# EAGLE design vco (EAGLE 9.6.2)

## Sheet 1 of 2
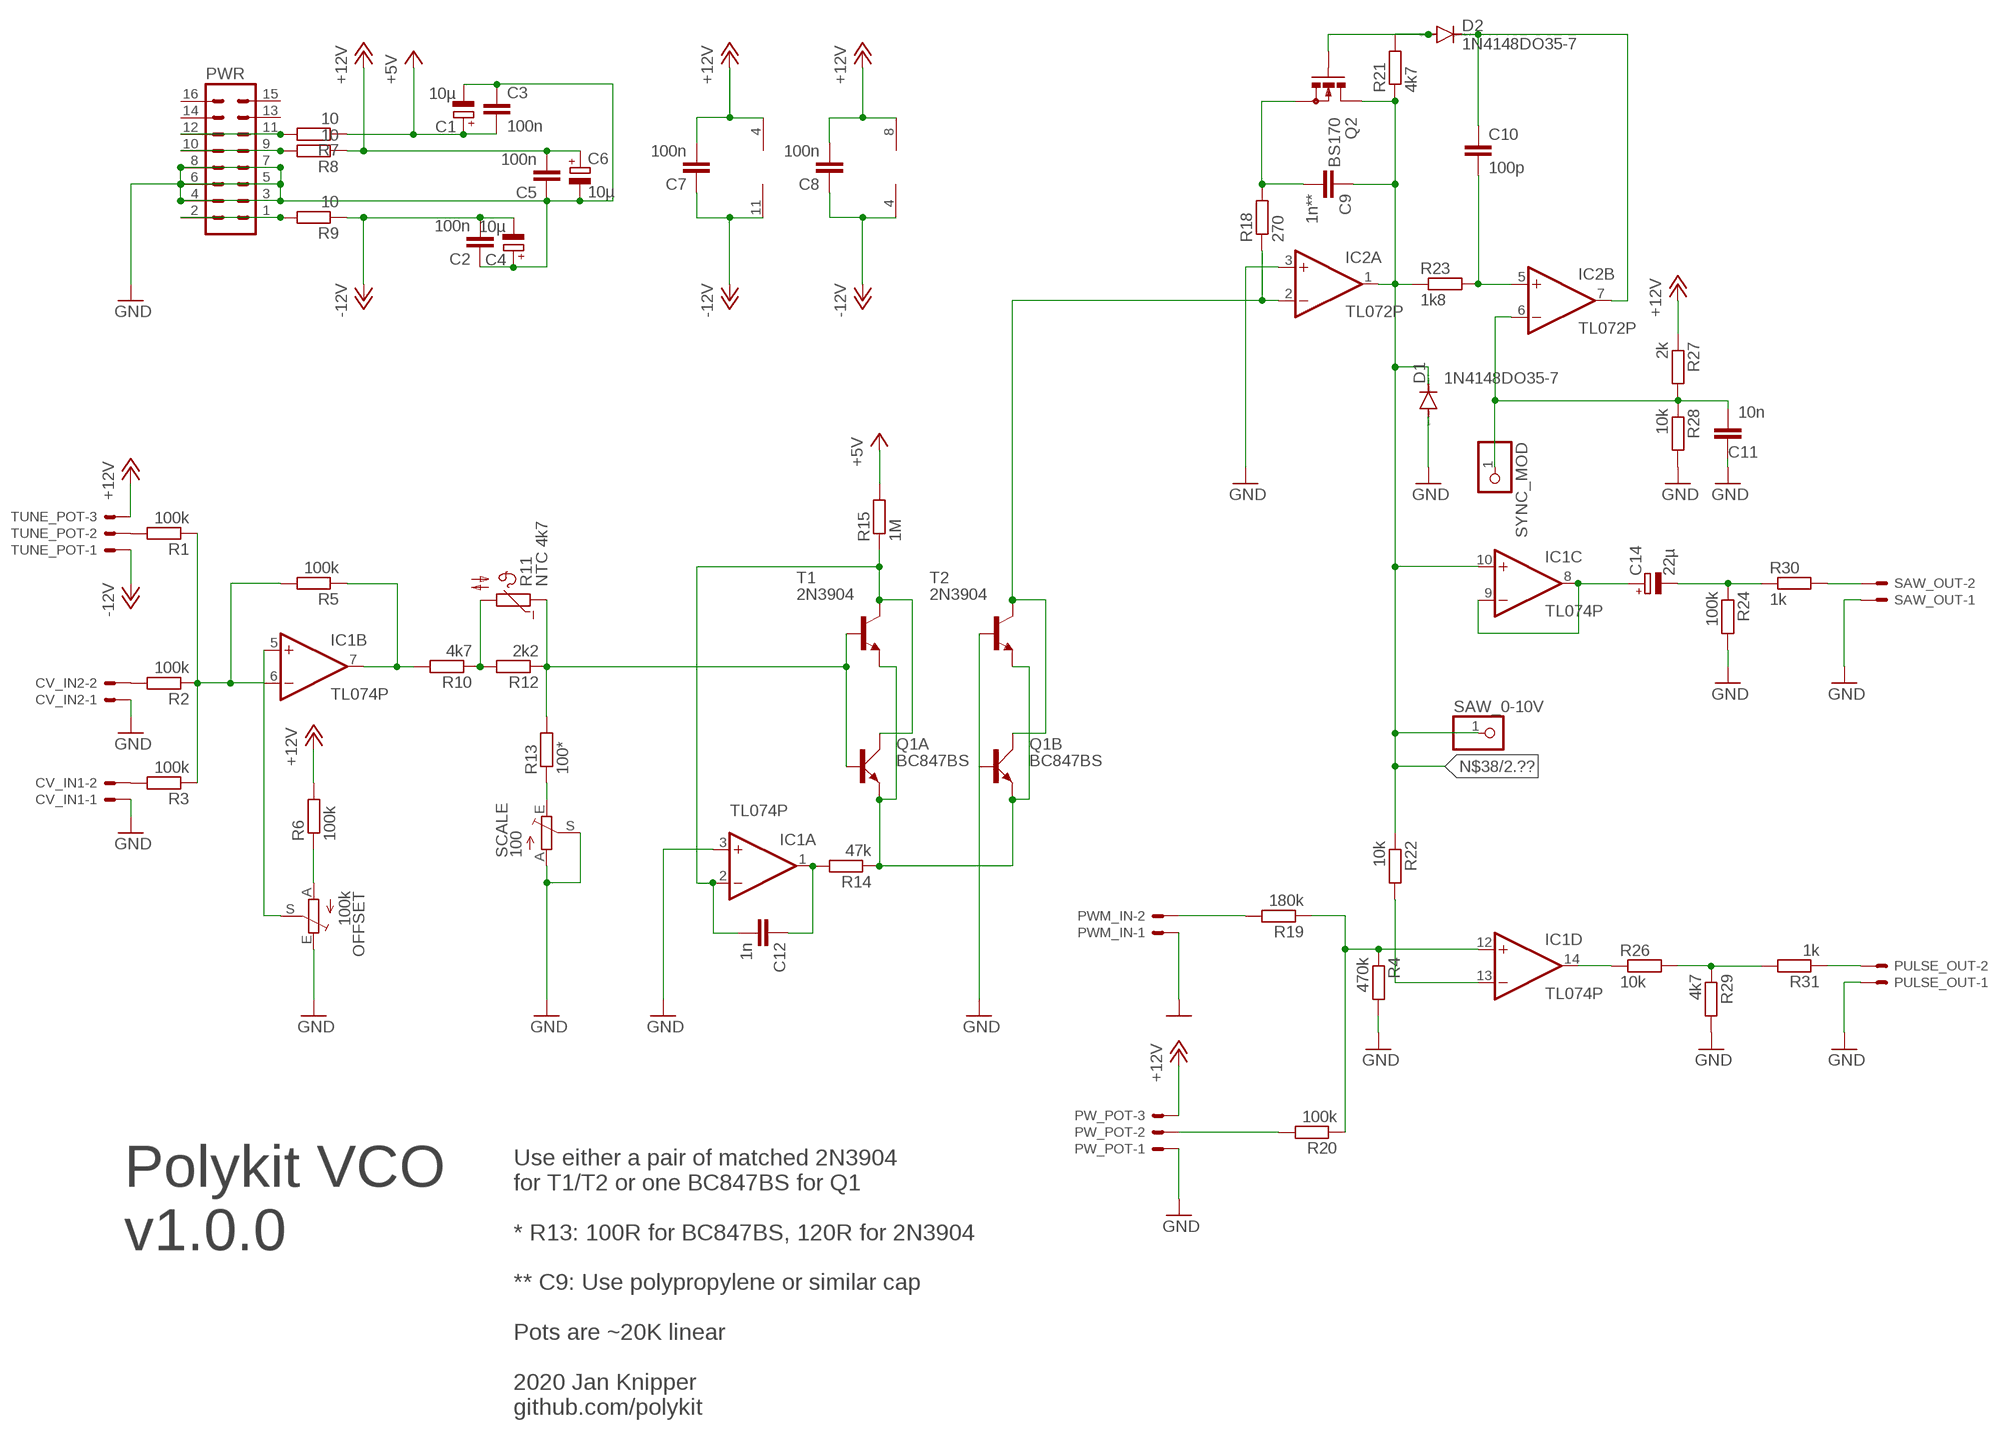
[diagram p0: schematic, sheet 1]

### Parts
C1  10µ  CPOL-EUE2.5-5  [E2,5-5]
C2  100n  C-EU050-030X075  [C050-030X075]
C3  100n  C-EU050-030X075  [C050-030X075]
C4  10µ  CPOL-EUE2.5-5  [E2,5-5]
C5  100n  C-EU050-030X075  [C050-030X075]
C6  10µ  CPOL-EUE2.5-5  [E2,5-5]
C7  100n  C-EU050-030X075  [C050-030X075]
C8  100n  C-EU050-030X075  [C050-030X075]
C9  1n**  C-EU050-030X075  [C050-030X075]
C10  100p  C-EU050-030X075  [C050-030X075]
C11  10n  C-EU050-030X075  [C050-030X075]
C12  1n  C-EU050-024X044  [C050-024X044]
C14  22µ  CPOL-EUE2.5-5  [E2,5-5]
CV_IN1  22-23-2021  [22-23-2021]
CV_IN2  22-23-2021  [22-23-2021]
D1  1N4148DO35-7  [DO35-7]
D2  1N4148DO35-7  [DO35-7]
IC1  TL074P  [DIL14]
IC2  TL072P  [DIL08]
OFFSET  100k  TRIM_1234-S64YW  [S64YW]
PULSE_OUT  22-23-2021  [22-23-2021]
PW_POT  22-23-2031  [22-23-2031]
PWM_IN  22-23-2021  [22-23-2021]
PWR  ML16  [ML16]
Q1  BC847BS  [SOT363_PHILIPS]
Q2  BS170  [SOT54E]
R1  100k  R-EU_0207/7  [0207/7]
R2  100k  R-EU_0207/7  [0207/7]
R3  100k  R-EU_0207/7  [0207/7]
R4  470k  R-EU_0207/7  [0207/7]
R5  100k  R-EU_0207/7  [0207/7]
R6  100k  R-EU_0207/7  [0207/7]
R7  10  R-EU_0207/7  [0207/7]
R8  10  R-EU_0207/7  [0207/7]
R9  10  R-EU_0207/7  [0207/7]
R10  4k7  R-EU_0207/7  [0207/7]
R11  NTC 4k7  NTC640  [P640]
R12  2k2  R-EU_0207/7  [0207/7]
R13  100*  R-EU_0207/7  [0207/7]
R14  47k  R-EU_0207/7  [0207/7]
R15  1M  R-EU_0207/7  [0207/7]
R18  270  R-EU_0207/7  [0207/7]
R19  180k  R-EU_0207/7  [0207/7]
R20  100k  R-EU_0207/7  [0207/7]
R21  4k7  R-EU_0207/7  [0207/7]
R22  10k  R-EU_0207/7  [0207/7]
R23  1k8  R-EU_0207/7  [0207/7]
R24  100k  R-EU_0207/7  [0207/7]
R26  10k  R-EU_0207/7  [0207/7]
R27  2k  R-EU_0207/7  [0207/7]
R28  10k  R-EU_0207/7  [0207/7]
R29  4k7  R-EU_0207/7  [0207/7]
R30  1k  R-EU_0207/7  [0207/7]
R31  1k  R-EU_0207/7  [0207/7]
SAW_0-10V  PINHD-1X1  [1X01]
SAW_OUT  22-23-2021  [22-23-2021]
SCALE  100  TRIM_1234-S64YW  [S64YW]
SYNC_MOD  PINHD-1X1  [1X01]
T1  2N3904  [TO92]
T2  2N3904  [TO92]
TUNE_POT  22-23-2031  [22-23-2031]

### Nets
+5V: C1.+ C3.2 R7.1 R15.2
+12V: C5.2 C6.+ C7.2 C8.2 IC1.4(P:V+) IC2.8(P:V+) PW_POT.3 R6.2 R8.1 R27.1 TUNE_POT.3 ; also sheet 2
-12V: C2.2 C4.- C7.1 C8.1 IC1.11(P:V-) IC2.4(P:V-) R9.1 TUNE_POT.1
GND: C1.- C2.1 C3.1 C4.+ C5.1 C6.- C11.1 CV_IN1.1 CV_IN2.1 D1.A IC1.3(A:+IN) IC2.3(A:+IN) OFFSET.E PULSE_OUT.1 PW_POT.1 PWM_IN.1 PWR.3 PWR.4 PWR.5 PWR.6 PWR.7 PWR.8 Q1.5(B:B) R4.2 R24.2 R28.2 R29.2 SAW_OUT.1 SCALE.A SCALE.S T2.2(B) ; also sheet 2
N$1: PWR.1 PWR.2 R9.2
N$2: Q1.1(A:E) Q1.4(B:E) R14.1 T1.3(E) T2.3(E)
N$3: C12.2 IC1.2(A:-IN) Q1.6(A:C) R15.1 T1.1(C)
N$4: PWR.9 PWR.10 R8.2
N$5: Q1.2(A:B) R11.1 R12.1 R13.2 T1.2(B)
N$6: C14.- R24.1 R30.1
N$7: PULSE_OUT.2 R31.1
N$9: IC1.7(B:OUT) R5.1 R10.2
N$10: R1.2 TUNE_POT.2
N$11: C10.1 D2.C IC2.7(B:OUT)
N$14: OFFSET.A R6.1
N$15: CV_IN2.2 R2.2
N$16: CV_IN1.2 R3.2
N$19: C14.+ IC1.8(C:OUT) IC1.9(C:-IN)
N$20: R30.2 SAW_OUT.2
N$22: IC1.13(D:-IN) R22.2
N$24: IC1.14(D:OUT) R26.1
N$25: R26.2 R29.1 R31.2
N$26: IC1.12(D:+IN) R4.1 R19.1 R20.1
N$27: PWM_IN.2 R19.2
N$28: PW_POT.2 R20.2
N$29: IC1.5(B:+IN) OFFSET.S
N$30: R10.1 R11.2 R12.2
N$31: C10.2 IC2.5(B:+IN) R23.2
N$33: PWR.11 PWR.12 R7.2
N$34: C12.1 IC1.1(A:OUT) R14.2
N$36: C9.2 Q2.S R18.2
N$37: D2.A Q2.G R21.2
N$38: C9.1 D1.C IC1.10(C:+IN) IC2.1(A:OUT) Q2.D R21.1 R22.1 R23.1 SAW_0-10V.1 ; also sheet 2
N$39: C11.2 IC2.6(B:-IN) R27.2 R28.1 SYNC_MOD.1
N$40: IC2.2(A:-IN) Q1.3(B:C) R18.1 T2.1(C)
N$50: R13.1 SCALE.E
N$51: IC1.6(B:-IN) R1.1 R2.1 R3.1 R5.2
Unconnected: OFFSET.S@1(S) PWR.13 PWR.14 PWR.15 PWR.16 SCALE.S@1(S)

### Notes on the sheet
- Use either a pair of matched 2N3904
  for T1/T2 or one BC847BS for Q1
  
  * R13: 100R for BC847BS, 120R for 2N3904
  
  ** C9: Use polypropylene or similar cap
  
  Pots are ~20K linear
  
  2020 Jan Knipper
  github.com/polykit
- Polykit VCO
  v1.0.0

## Sheet 2 of 2
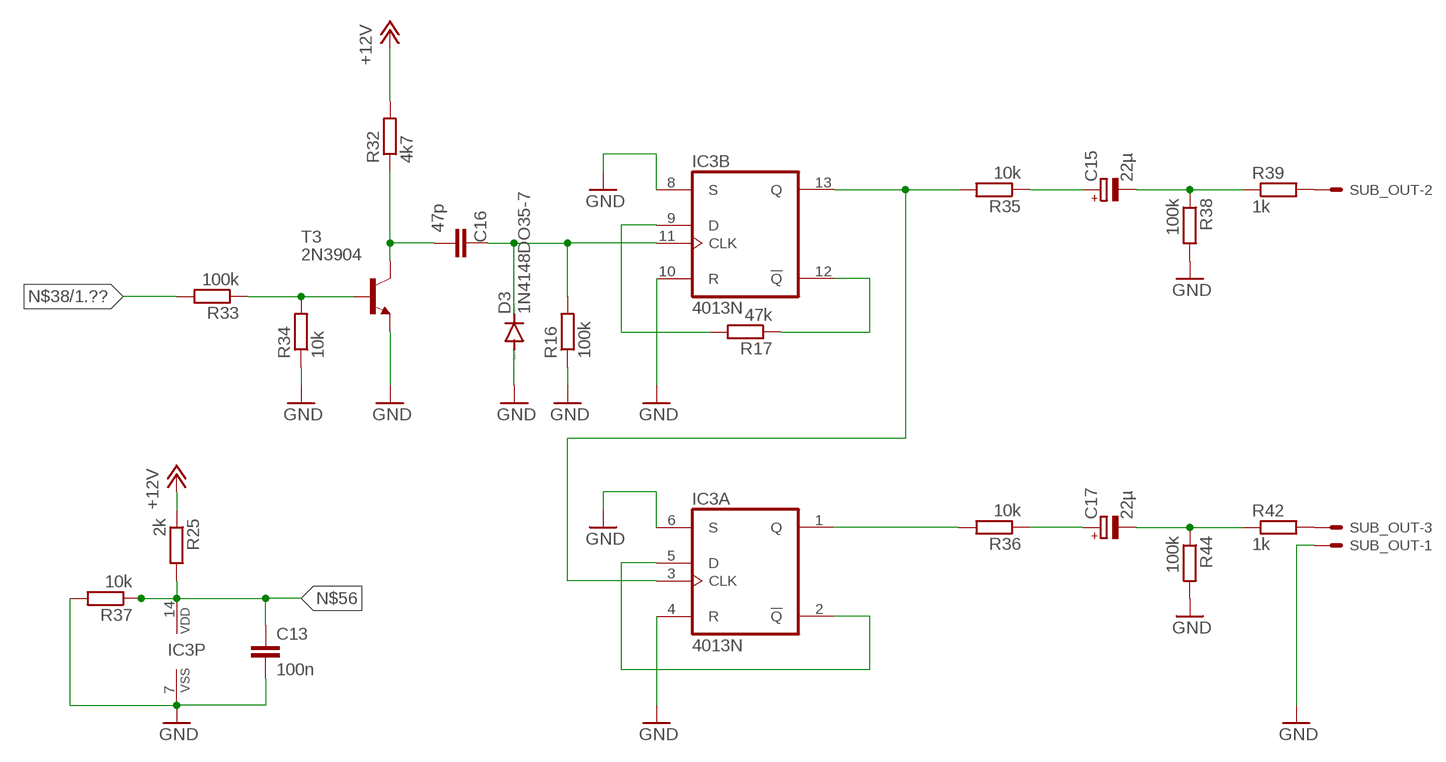
[diagram p1: schematic, sheet 2]

### Parts
C13  100n  C-EU050-030X075  [C050-030X075]
C15  22µ  CPOL-EUE2.5-5  [E2,5-5]
C16  47p  C-EU050-030X075  [C050-030X075]
C17  22µ  CPOL-EUE2.5-5  [E2,5-5]
D3  1N4148DO35-7  [DO35-7]
IC3  4013N  [DIL14]
R16  100k  R-EU_0207/7  [0207/7]
R17  47k  R-EU_0207/7  [0207/7]
R25  2k  R-EU_0207/7  [0207/7]
R32  4k7  R-EU_0207/7  [0207/7]
R33  100k  R-EU_0207/7  [0207/7]
R34  10k  R-EU_0207/7  [0207/7]
R35  10k  R-EU_0207/7  [0207/7]
R36  10k  R-EU_0207/7  [0207/7]
R37  10k  R-EU_0207/7  [0207/7]
R38  100k  R-EU_0207/7  [0207/7]
R39  1k  R-EU_0207/7  [0207/7]
R42  1k  R-EU_0207/7  [0207/7]
R44  100k  R-EU_0207/7  [0207/7]
SUB_OUT  22-23-2031  [22-23-2031]
T3  2N3904  [TO92]

### Nets
+12V: R25.1 R32.2 ; also sheet 1
GND: C13.2 D3.A IC3.4(A:R) IC3.6(A:S) IC3.7(P:VSS) IC3.8(B:S) IC3.10(B:R) R16.1 R34.1 R37.2 R38.2 R44.2 SUB_OUT.1 T3.3(E) ; also sheet 1
N$8: R42.2 SUB_OUT.3
N$12: R33.1 R34.2 T3.2(B)
N$13: C16.1 D3.C IC3.11(B:CLK) R16.2
N$17: IC3.9(B:D) R17.2
N$18: IC3.12(B:!Q) R17.1
N$21: C16.2 R32.1 T3.1(C)
N$23: C15.+ R35.1
N$32: C15.- R38.1 R39.1
N$38: R33.2 ; also sheet 1
N$44: IC3.2(A:!Q) IC3.5(A:D)
N$45: IC3.3(A:CLK) IC3.13(B:Q) R35.2
N$46: IC3.1(A:Q) R36.2
N$47: C17.+ R36.1
N$48: R39.2 SUB_OUT.2
N$55: C17.- R42.1 R44.1
N$56: C13.1 IC3.14(P:VDD) R25.2 R37.1

## Library data of the parts
C1 C4 C6 C14 C15 C17 = rcl:CPOL-EU: POLARIZED CAPACITOR, European symbol; SPICEPREFIX: C
C2 C3 C5 C7-C13 C16 = rcl:C-EU: CAPACITOR, European symbol; SPICEPREFIX: C
CV_IN1 CV_IN2 PULSE_OUT PWM_IN SAW_OUT = con-molex:22-23-2021: .100" (2.54mm) Center Header - 2 Pin; MF: MOLEX; MPN: 22-23-2021; OC_FARNELL: 1462926; OC_NEWARK: 25C3832
D1-D3 = diode:1N4148: DIODE high speed (Philips)
IC1 = linear:TL074: OP AMP
IC2 = linear:TL072: OP AMP
IC3 = 40xx:4013: Dual D FLIP FLOP, set/reset
OFFSET SCALE = pot:TRIM_1234-: POTENTIOMETER
PW_POT SUB_OUT TUNE_POT = con-molex:22-23-2031: .100" (2.54mm) Center Header - 3 Pin; MF: MOLEX; MPN: 22-23-2031; OC_FARNELL: 1462950; OC_NEWARK: 30C0862
PWR = con-harting-ml:ML16: HARTING; OC_FARNELL: unknown; OC_NEWARK: unknown
Q1 = transistor-small-signal:BC847BS: NPN general purpose double transistor Source: http://www.farnell.com/datasheets/2466.pdf
Q2 = transistor-small-signal:BS170: N-CHANNEL MOS FET
R1-R10 R12-R39 R42 R44 = rcl:R-EU_: RESISTOR, European symbol; SPICEPREFIX: R
R11 = ptc-ntc:NTC640: PHILIPS NTC; OC_FARNELL: unknown; OC_NEWARK: unknown
SAW_0-10V SYNC_MOD = pinhead:PINHD-1X1: PIN HEADER
T1-T3 = transistor:2N3904: NPN TRANSISTOR

## Board
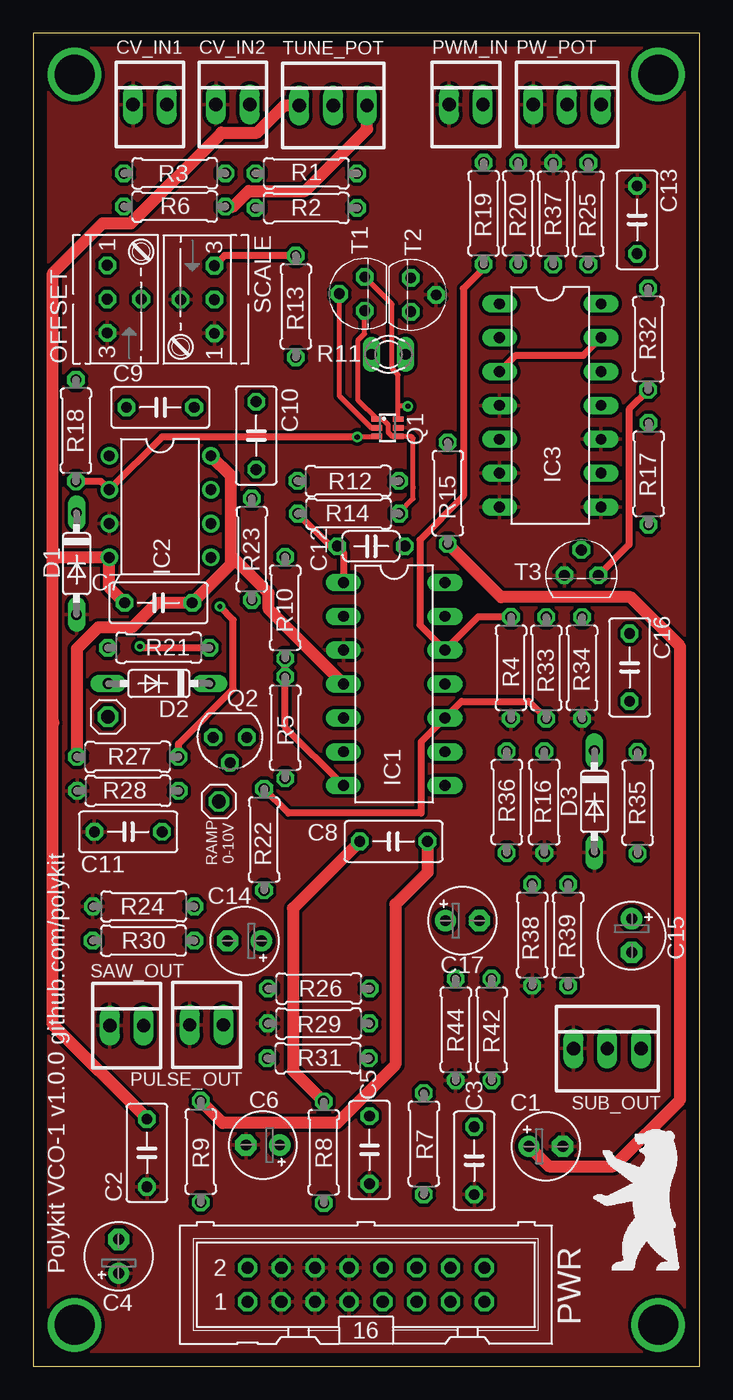
[diagram p2: board, top side]
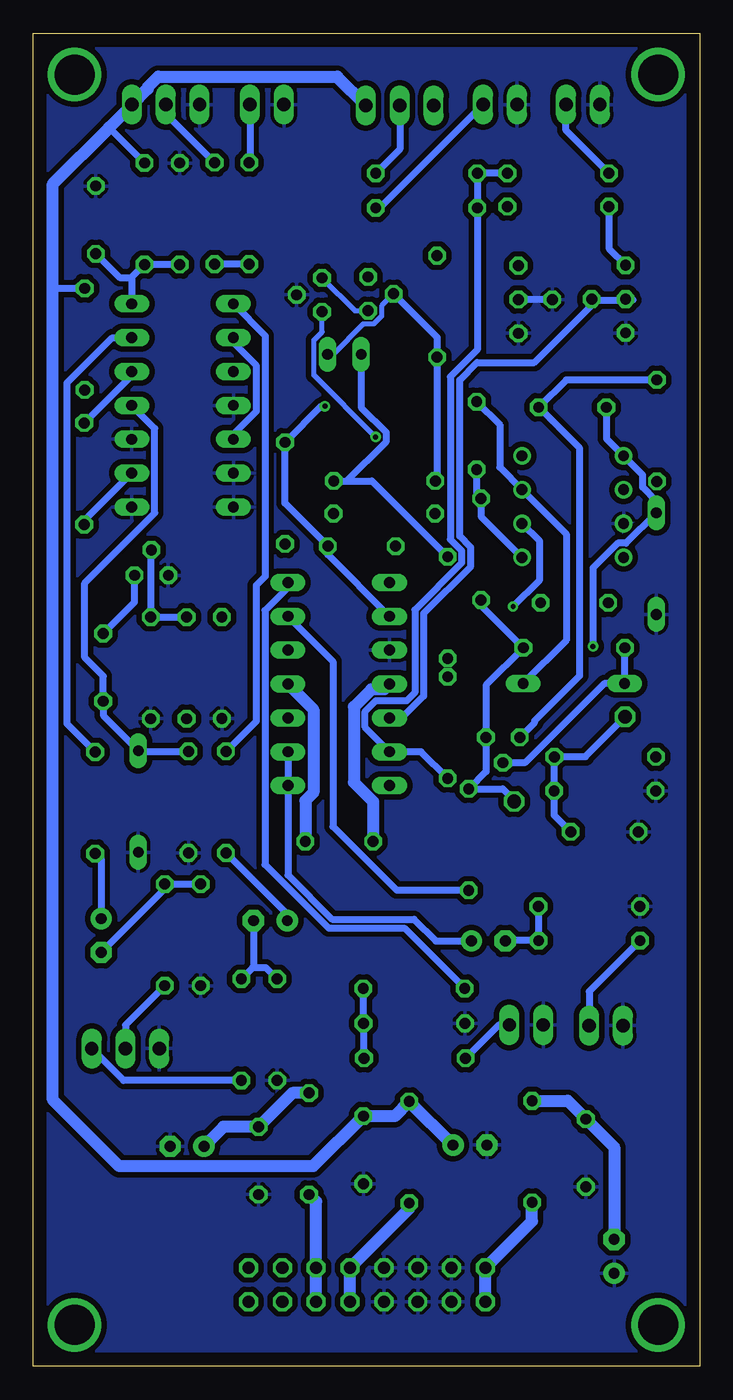
[diagram p3: board, bottom side, seen from below]

Size 50 x 100 mm. Coordinates in mm from the lower left corner, seen from the top.
Outline: 0,0 50,0 50,100 0,100 0,0
Copper layers (1*16): Top 0.035mm / dielectric 1.5mm / Bottom 0.035mm
Design rules "default": minimum track width 6mil, minimum drill 0.35mm, track to track 6mil, track to pad 6mil, pad to pad 6mil, via to via 6mil, smd to smd 6mil, copper to edge 40mil, drill to drill 6mil, minimum pad ring 10mil, minimum via ring 8mil, stop-mask expansion 4mil, vias tented up to drill 0mil, thermal gap 10mil

### Footprints (pad centres in the part's own frame; a part is rotated, then mirrored left to right if it is on the bottom)
E2,5-5 = drill 0.813 pad 1.6: + -1.27,0 | drill 0.813 pad 1.6 octagon: - 1.27,0
C050-030X075 = drill 0.813 octagon: 1 -2.54,0; 2 2.54,0
C050-024X044 = drill 0.813 octagon: 1 -2.54,0; 2 2.54,0
22-23-2021 = drill 1 long: 1 -1.27,0; 2 1.27,0
DO35-7 = drill 0.813 long: A 3.81,0; C -3.81,0
DIL14 = drill 0.813 long: 1 -7.62,-3.81; 2 -5.08,-3.81; 3 -2.54,-3.81; 4 0,-3.81; 5 2.54,-3.81; 6 5.08,-3.81; 7 7.62,-3.81; 8 7.62,3.81; 9 5.08,3.81; 10 2.54,3.81; 11 0,3.81; 12 -2.54,3.81; 13 -5.08,3.81; 14 -7.62,3.81
DIL08 = drill 0.813 pad 1.27: 1 -3.81,-3.81; 2 -1.27,-3.81; 3 1.27,-3.81; 4 3.81,-3.81; 5 3.81,3.81; 6 1.27,3.81; 7 -1.27,3.81; 8 -3.81,3.81
S64YW = drill 0.813 octagon: A 2.54,1.27; E -2.54,1.27; S 0,-1.27; S@1 0,1.27
22-23-2031 = drill 1 long: 1 -2.54,0; 2 0,0; 3 2.54,0
ML16 = drill 0.914 octagon: 1 -8.89,-1.27; 2 -8.89,1.27; 3 -6.35,-1.27; 4 -6.35,1.27; 5 -3.81,-1.27; 6 -3.81,1.27; 7 -1.27,-1.27; 8 -1.27,1.27; 9 1.27,-1.27; 10 1.27,1.27; 11 3.81,-1.27; 12 3.81,1.27; 13 6.35,-1.27; 14 6.35,1.27; 15 8.89,-1.27; 16 8.89,1.27
SOT363_PHILIPS = smd 0.4 x 0.8: 1 -0.65,-0.8; 2 0,-0.8; 3 0.65,-0.8; 4 0.65,0.8; 5 0,0.8; 6 -0.65,0.8
SOT54E = drill 0.813 octagon: D -1.27,0; G 0,1.905; S 1.27,0
0207/7 = drill 0.813 octagon: 1 -3.81,0; 2 3.81,0
P640 = drill 0.813 long: 1 -1.27,0; 2 1.27,0
1X01 = drill 1.016 octagon: 1 0,0
TO92 = drill 0.813 octagon: 1 1.27,0; 2 0,1.905; 3 -1.27,0

### Placement (x,y rotation side)
C1  38.46,16.5 0 top
C2  8.53,16 90 top
C3  33.09,15.42 90 top
C4  6.41,8.24 90 top
C5  25.23,16.22 90 top
C6  17.23,16.59 180 top
C7  9.39,57.27 0 top
C8  27.04,39.37 180 top
C9  9.53,71.94 0 top
C10  16.73,69.82 270 top
C11  7.12,40.09 0 top
C12  25.35,61.52 0 top
C13  45.31,86 90 top
C14  15.85,31.9 180 top
C15  44.91,32.31 270 top
C16  44.75,52.43 90 top
C17  32.21,33.43 0 top
CV_IN1  8.75,94.65 0 top
CV_IN2  14.97,94.65 0 top
D1  3.24,60.21 270 top
D2  9.43,51.21 180 top
D3  42.11,42.37 270 top
IC1  27.08,51.18 270 top
IC2  9.51,64.49 270 top
IC3  38.8,72.08 270 top
OFFSET  6.82,80.06 90 top
PULSE_OUT  13,25.6 0 top
PW_POT  40.06,94.65 0 top
PWM_IN  32.47,94.65 0 top
PWR  24.96,6.11 0 top
Q1  26.58,70.41 270 top
Q2  14.76,47.18 180 top
R1  20.49,89.5 0 top
R2  20.49,86.9 0 top
R3  10.61,89.5 180 top
R4  35.85,52.4 270 top
R5  18.9,47.91 270 top
R6  10.61,87 0 top
R7  29.31,16.69 270 top
R8  21.79,16.05 270 top
R9  12.56,16.1 270 top
R10  18.9,56.91 270 top
R11  26.66,75.91 180 top
R12  23.64,66.41 0 top
R13  19.7,79.51 270 top
R14  23.66,63.97 180 top
R15  31.11,65.5 270 top
R16  38.35,42.32 90 top
R17  46.18,66.95 270 top
R18  3.2,70.19 90 top
R19  33.8,86.49 90 top
R20  36.39,86.49 90 top
R21  9.41,53.9 180 top
R22  17.32,39.51 270 top
R23  16.4,61.29 90 top
R24  8.28,34.49 180 top
R25  41.65,86.46 270 top
R26  21.43,28.34 0 top
R27  7.08,45.71 0 top
R28  7.1,43.17 180 top
R29  21.41,25.72 180 top
R30  8.27,31.93 180 top
R31  21.37,23.11 0 top
R32  46.15,77.05 90 top
R33  38.49,52.39 270 top
R34  41.18,52.39 90 top
R35  45.36,42.27 90 top
R36  35.54,42.32 90 top
R37  39.01,86.46 90 top
R38  37.44,32.36 270 top
R39  40.13,32.36 270 top
R42  34.39,25.25 270 top
R44  31.7,25.25 270 top
SAW_0-10V  13.92,42.37 0 top
SAW_OUT  7.01,25.55 0 top
SCALE  12.32,80.03 270 top
SUB_OUT  43.08,23.83 0 top
SYNC_MOD  5.59,48.72 0 top
T1  24.87,80.46 90 top
T2  28.33,80.38 270 top
T3  41.13,59.34 0 top
TUNE_POT  22.5,94.6 0 top

### Tracks (layer width: path | path; a pad name or v marks a point on that pad's centre or on a via)
+5V
  Top 0.889: R15.2 35.09,57.71 44.82,57.71 48.54,53.98 48.54,20 43.54,15 38.69,15 C1.+
  Bottom 0.889: R7.1 30.56,20.5 C3.2 35.73,17.96 C1.+
+12V
  Top 0.889: R8.1 19.49,22.16 19.49,34.36 C8.2 | R6.2 15,87 16.16,88.16 20.39,88.16 25.04,92.81 TUNE_POT.3 | R27.1 3.27,53.82 4.88,55.42 7.42,55.42 9.26,57.27 C7.2 14.83,60.17 14.83,60.82 | IC1.4 17.66,56.79 17.66,58 14.83,60.82 | IC2.8 14.83,66.79 14.83,60.82
  Bottom 0.508: R32.2 48.5,80.86 48.54,80.82 | R25.1 44.32,92.93
  Bottom 0.889: C6.+ 18.52,16.59 R8.1 22.89,18.76 C5.2 28.99,15 43.54,15 48.54,20 48.54,80.82 48.54,88.71 44.32,92.93 PW_POT.3 41.41,95.84 41.41,95.96 40.62,96.75 27.2,96.75 TUNE_POT.3 | IC1.4 23.66,50.79 24.64,50.79 25.95,49.47 25.95,43.8 24.5,42.35 C8.2
-12V
  Top 0.889: 1.46,48.31 1.46,25.61 C2.2 | 1.46,48.31 1.46,61 | 1.46,61 1.46,82 5.2,85.74 7.32,85.74 14.12,92.55 16.8,92.55 18.85,94.6 TUNE_POT.1 | 1.46,61 1.78,60.68 IC2.4 5.7,58.42 C7.1 | R9.1 14.22,18.25 22.81,18.25 27.18,22.62 27.18,34.65 29.58,37.05 C8.1 | 1.51,48.26 1.46,48.31
  Bottom 0.889: R9.1 9.9,19.91 C2.2 6.41,16.42 C4.- | C8.1 29.58,42.43 28.97,43.04 28.97,49.26 IC1.11
GND
  Top 0.381: Q1.5
  Bottom 0.508: SCALE.S 13.97,80.03 14,80
  pour Bottom (isolate 0.406): 0,100 50,100 50,0 0,0
  pour Top (isolate 0.254): 0,100 50,100 50,0 0,0
N$1
  Bottom 0.889: PWR.1 PWR.2 12.56,10.89 R9.2
N$2
  Top 0.381: T1.3 24.87,77.47 24.39,76.98 24.39,72.45 Q1.1 26.22,71.05 26.64,70.64 26.64,70.07 26.95,69.76 Q1.4 28.37,69.76 28.5,69.63 28.5,65.92 28.5,65.08 27.47,64.05 R14.1
  Bottom 0.381: T2.3 25.87,79.19 T1.3
N$3  (via drill 0.38)
  Top 0.381: Q1.6 27.38,72.12 | 27.38,72.12 27.38,74.38 26.93,74.83 26.93,79.67 T1.1 | v28.11,72.02 27.48,72.02 27.38,72.12
  Bottom 0.508: IC1.2 27.89,60.88 C12.2 31.11,64.74 R15.1 28.4,72.02 v28.11,72.02
N$4
  Bottom 0.889: PWR.9 PWR.10 21.79,11.82 R8.2
N$5
  Top 0.381: Q1.2 25.34,70.42 22.96,72.79 T1.2
  Bottom 0.381: R11.1 27.52,75.91 25.24,78.18 24.45,78.18 23.87,78.77 23.87,79.56 T1.2
  Bottom 0.508: T1.2 19.7,77.19 R13.2 19.7,66.54 R12.1
N$6
  Bottom 0.508: R24.1 R30.1 14.55,31.93 C14.-
N$7
  Bottom 0.508: PULSE_OUT.2 15.06,25.6 R31.1
N$8
  Bottom 0.508: R42.2 43.23,21.44 SUB_OUT.3
N$9
  Top 0.508: IC1.7 18.9,47.93 R5.1 R10.2
N$10
  Bottom 0.508: TUNE_POT.2 22.5,91.3 R1.2
N$11
  Bottom 0.508: C10.1 15,70.64 15,67.44 IC2.7 10,62.44 10,54.45 D2.C
N$12
  Bottom 0.508: R33.1 R34.2 41.18,61.19 T3.2
N$13
  Bottom 0.508: R16.2 42.06,46.13 D3.C 44.76,48.82 C16.1 44.76,51.78 46.13,53.15 46.13,58.77 40.88,64.02 40.88,70.36 IC3.11
N$14
  Bottom 0.508: R6.1 6.8,83.85 OFFSET.A
N$15
  Bottom 0.508: CV_IN2.2 23.99,86.9 R2.2
N$16
  Bottom 0.508: R3.2 10.02,92.72 CV_IN1.2
N$17
  Bottom 0.508: R17.2 46.18,63.43 IC3.9
N$18
  Bottom 0.508: R17.1 42.61,74.33 IC3.12
N$19
  Bottom 0.508: IC1.9 IC1.8 30.89,36.85 27.57,33.53 21.42,33.53 19.79,31.9 C14.+
N$20
  Bottom 0.508: 4.5,31.89 R30.2 8.28,28.11 SAW_OUT.2
N$21
  Top 0.508: R32.1 44.7,71.8 44.7,61.64 T3.1
  Bottom 0.508: C16.2 42.4,57.32 T3.1
N$22
  Bottom 0.508: IC1.13 27.51,52.88 27.51,40.49 22.73,35.71 17.34,35.71 R22.2
N$23
  Bottom 0.508: R35.1 44.9,38 C15.+
N$24
  Bottom 0.508: IC1.14 30.89,58.43 32.62,56.7 32.62,37.64 27.84,32.87 22.15,32.87 R26.1
N$25
  Bottom 0.508: R31.2 25.18,25.68 R29.1 25.22,28.32 R26.2
N$26
  Top 0.508: R19.1 33.8,82.4 32.26,80.86 32.26,65.26 29,62 29,55.61 IC1.12 33.38,56.21 R4.1
  Bottom 0.508: R19.1 R20.1
N$27
  Bottom 0.508: PWM_IN.2 33.74,90.36 R19.2
N$28
  Bottom 0.508: PW_POT.2 40.06,93.97 R20.2
N$29
  Bottom 0.508: 5,80 8.03,80 OFFSET.S 8.09,79.61 12.4,75.3 16.7,75.3 18,74 18,62.26 17.17,61.44 17.17,60.01 20.71,56.47 20.71,50.27 22.25,48.73 22.25,48.67 22.28,48.64 IC1.5
N$30
  Bottom 0.508: R11.2 25.39,71.93 23.51,70.05 23.51,69.39 26.48,66.41 R12.2 24.59,66.41 R10.1
N$31
  Bottom 0.508: C10.2 16.73,65.43 R23.2 16.4,63.76 IC2.5
N$32
  Bottom 0.508: C15.- 40.13,35.81 R39.1 R38.1
N$33
  Bottom 0.889: PWR.11 PWR.12 28.77,12.34 R7.2
N$34
  Top 0.508: R14.2 22.3,61.52 C12.1 23.27,61.06 IC1.1
N$35  (via drill 3)
  other vias: 3.1,96.9
N$36
  Bottom 0.508: R18.2 10.01,74 C9.2 9,68.87 9,51.81 12.37,48.44 12.37,48.3 Q2.S
N$37
  Bottom 0.508: R21.2 5.62,53.88 D2.A 7.16,51.21 8.15,50.22 13.11,45.26 14.75,45.26 Q2.G
N$38  (via drill 0.38 pad 0.51)
  Top 0.508: R22.1 19.14,41.5 29.1,41.5 29.1,46.85 IC1.10 32.14,49.89 37.19,49.89 R33.2 | R21.1 8.1,53.9 v8,54
  Bottom 0.508: C9.1 6.99,69.59 IC2.1 4.27,66.87 4.27,65.94 3.24,64.91 D1.C 5.51,61.75 6.14,61.75 8,59.89 v8,54 | R23.1 16.4,57.08 R21.1 16.03,51.09 Q2.D 16.03,44.61 R22.1 | R22.1 17.3,43.3 | R22.1 14.77,43.32 13.92,42.47 SAW_0-10V.1
N$39  (via drill 0.35 pad 0.51)
  Top 0.508: R27.2 10.89,46.7 15,50.8 15,56 v14,57
  Bottom 0.508: v14,57 12,59 12,61.9 IC2.6 | C11.2 10.91,41.34 R28.1 10.91,45.69 R27.2 8.54,45.71 8.54,45.77 SYNC_MOD.1
N$40  (via drill 0.38)
  Top 0.381: v24.31,69.72 24.35,69.76 Q1.3
  Top 0.508: R18.1 5.08,66.38 IC2.2 9.66,69.72 v24.31,69.72
  Bottom 0.381: T2.1 28.33,77.59 28.93,76.98 28.93,74.34 v24.31,69.72
N$41  (via drill 3)
  other vias: 46.9,96.9
N$42  (via drill 3)
  other vias: 46.9,3.1
N$43  (via drill 3)
  other vias: 3.1,3.1
N$44
  Bottom 0.508: IC3.5 34.99,69.91 33.26,71.64 33.26,75.06 34.99,76.79 IC3.2
N$45
  Top 0.508: IC3.3 36.21,75.84 41.29,75.84 IC3.13
  Bottom 0.508: R35.2 47.47,48.18 47.47,73.78 44.08,77.16 IC3.13
N$46
  Bottom 0.508: IC3.1 32.6,77.31 32.6,59.26 33.28,58.58 33.28,48.39 R36.2
N$47
  Bottom 0.508: R36.1 30.94,33.91 C17.+
N$48
  Bottom 0.508: R39.2 43.08,25.6 SUB_OUT.2
N$50
  Top 0.508: R13.1 14.34,83.32 SCALE.E
N$51
  Bottom 0.508: R3.1 R1.1 R2.1 16.68,76.25 18.7,74.23 18.7,62.03 17.83,61.16 17.83,60.28 21.37,56.74 21.37,50.54 21.97,49.94 24.28,49.94 25.1,49.12 25.1,47.93 IC1.6 20.9,46.1 R5.2
N$55
  Bottom 0.508: C17.- 33.48,29.97 33.55,29.9 | 33.55,29.9 R42.1 | R44.1 32.54,29.9 33.55,29.9
N$56
  Bottom 0.508: R37.1 R25.2 42.61,81.7 42.61,81.69 | 42.61,81.69 IC3.14 | C13.1 43.54,81.69 42.61,81.69

### Text on the board
tPlace: RAMP / 0-10V | Polykit VCO-1 v1.0.0 github.com/polykit